# Altium project esp32 with lcd.PrjPcb
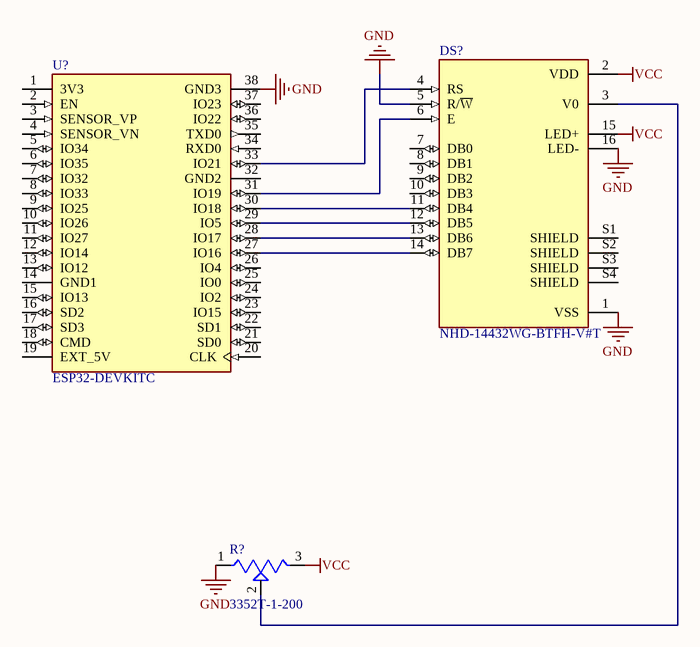
[diagram p0: Sheet1.SchDoc]
1 sheet, 3 parts. Net scope: global (net labels, ports and power ports of the same name join across sheets).
Board file: PCB1.PcbDoc

## Sheet Sheet1.SchDoc
size A; SheetNumber: 1; SheetTotal: 1

### Parts
DS?  NHD-14432WG-BTFH-V#T  [LCD_NHD-14432WG-BTFH-V#T]
R?  3352T-1-200  [TRIM_3352T-1-200]
U?  ESP32-DEVKITC  [MODULE_ESP32-DEVKITC]

### Nets
GND: DS?.1(VSS) DS?.5(R/~{W}) DS?.16(LED-) R?.1(CCW) U?.38(GND3)
VCC: DS?.2(VDD) DS?.15(LED+) R?.3(CW)
NetDS?_3: DS?.3(V0) R?.2(WIPER)
NetDS?_4: DS?.4(RS) U?.33(IO21)
NetDS?_6: DS?.6(E) U?.31(IO19)
NetDS?_11: DS?.11(DB4) U?.30(IO18)
NetDS?_12: DS?.12(DB5) U?.29(IO5)
NetDS?_13: DS?.13(DB6) U?.28(IO17)
NetDS?_14: DS?.14(DB7) U?.27(IO16)

Not connected (* = marked no-connect by the designer): DS? 7(DB0) 8(DB1) 9(DB2) 10(DB3) S1(SHIELD) S2(SHIELD) S3(SHIELD) S4(SHIELD); U? 1(3V3) 2(EN) 3(SENSOR_VP) 4(SENSOR_VN) 5(IO34) 6(IO35) 7(IO32) 8(IO33) 9(IO25) 10(IO26) 11(IO27) 12(IO14) 13(IO12) 14(GND1) 15(IO13) 16(SD2) 17(SD3) 18(CMD) 19(EXT_5V) 20(CLK) 21(SD0) 22(SD1) 23(IO15) 24(IO2) 25(IO0) 26(IO4) 32(GND2) 34(RXD0) 35(TXD0) 36(IO22) 37(IO23)

### Library data of the parts
DS? = NHD-14432WG-BTFH-V#T: - Graphic LCD Display Module Transflective Black (White - Inverted) FSTN - Film Super-Twisted Nematic Parallel, 8-Bit - 144 x 32; MF: Newhaven Display; SnapEDA_Link: https://www.snapeda.com/parts/NHD-14432WG-BTFH-V%23T/Newhaven+Display+Intl/view-part/?ref=snap; Package: None; MP: NHD-14432WG-BTFH-V#T; Check_prices: https://www.snapeda.com/parts/NHD-14432WG-BTFH-V%23T/Newhaven+Display+Intl/view-part/?ref=eda; Purchase-URL: https://pricing.snapeda.com/search/part/NHD-14432WG-BTFH-V#T/?ref=eda; Price: None; Value: *; Availability: In Stock
R? = 3352T-1-200: 20 Ohms 0.5W, 1/2W Through Hole Thumbwheel Potentiometer Top Adjustment; MF: Bourns; Price: None; Purchase-URL: https://pricing.snapeda.com/search/part/3352T-1-200/?ref=eda; Package: 3352T-3 Bourns; Check_prices: https://www.snapeda.com/parts/3352T-1-200/Bourns/view-part/?ref=eda; Availability: In Stock; MP: 3352T-1-200; Value: *; SnapEDA_Link: https://www.snapeda.com/parts/3352T-1-200/Bourns/view-part/?ref=snap
U? = ESP32-DEVKITC: ESP32-WROOM-32UE series Transceiver; 802.11 b/g/n (Wi-Fi, WiFi, WLAN), Bluetooth Â® Smart Ready 4.x Dual Mode Evaluation Board; MF: Espressif Systems; Value: *; SnapEDA_Link: https://www.snapeda.com/parts/ESP32-DEVKITC/Espressif+Systems/view-part/?ref=snap; MP: ESP32-DEVKITC; Purchase-URL: https://pricing.snapeda.com/search/part/ESP32-DEVKITC/?ref=eda; Check_prices: https://www.snapeda.com/parts/ESP32-DEVKITC/Espressif+Systems/view-part/?ref=eda; Availability: In Stock; Price: None; Package: None